# EAGLE design RGB Panel Shield for Arduino (EAGLE 9.0.0)
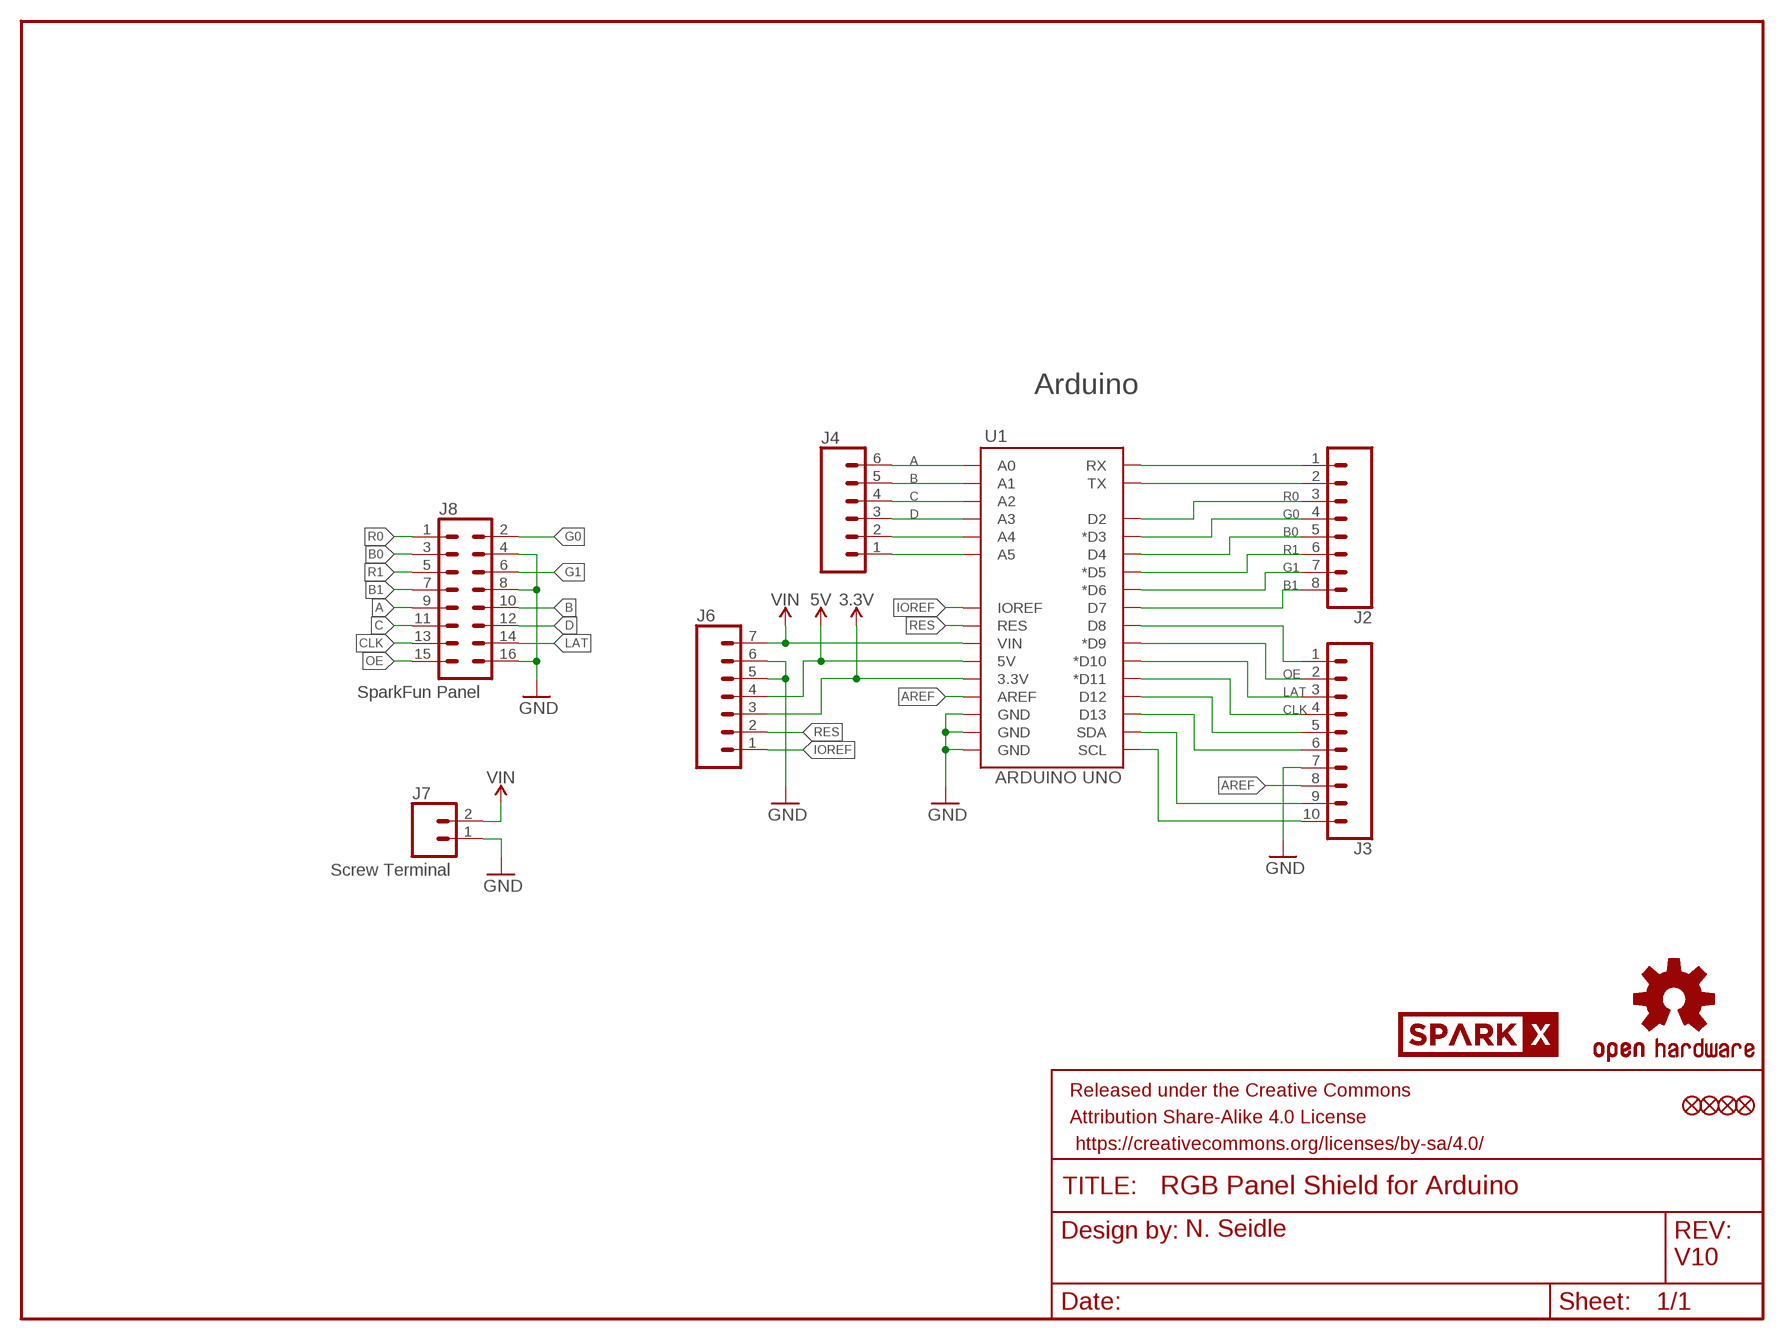
[diagram p0: schematic, sheet 1]

## Parts
FD1  FIDUCIAL1X2  [FIDUCIAL-1X2]
FD2  FIDUCIAL1X2  [FIDUCIAL-1X2]
FD3  FIDUCIAL1X2  [FIDUCIAL-1X2]
FD4  FIDUCIAL1X2  [FIDUCIAL-1X2]
FRAME1  FRAME-LETTER  [CREATIVE_COMMONS]
J2  CONN_08NO_SILK_FEMALE_PTH  [1X08_NO_SILK]
J3  CONN_10NO_SILK_PTH_FEMALE  [1X10_NO_SILK]
J4  CONN_06NO_SILK_FEMALE_PTH  [1X06_NO_SILK]
J6  CONN_07NO_SILK  [1X07_NO_SILK]
J7  Screw Terminal  CONN_025MM  [SCREWTERMINAL-5MM-2]
J8  SparkFun Panel  CONN_08X2_SHROUD  [2X8-SHROUDED_LOCK]
LOGO1  OSHW-LOGOMINI  [OSHW-LOGO-MINI]
U1  ARDUINO UNO  ARDUINO_R3_SHIELDNOLABELS  [UNO_R3_SHIELD_NOLABELS]
U$91  SPARKX-LOGO4  [SPARKX-MEDIUM]

## Nets
3.3V: J6.3 U1.3.3V
5V: J6.4 U1.5V
A: J4.6 J8.9 U1.A0
A4: J4.2 U1.A4
A5: J4.1 U1.A5
AREF: J3.8 U1.AREF
B: J4.5 J8.10 U1.A1
B0: J2.5 J8.3 U1.D4
B1: J2.8 J8.7 U1.D7
C: J4.4 J8.11 U1.A2
CLK: J3.4 J8.13 U1.D11(*D11)
D: J4.3 J8.12 U1.A3
D8: J3.1 U1.D8
D12: J3.5 U1.D12
D13: J3.6 U1.D13
G0: J2.4 J8.2 U1.D3(*D3)
G1: J2.7 J8.6 U1.D6(*D6)
GND [vcc]: J3.7 J6.5 J6.6 J7.1 J8.4 J8.8 J8.16 U1.GND@0(GND) U1.GND@1(GND) U1.GND@2(GND)
IOREF: J6.1 U1.IOREF
LAT: J3.3 J8.14 U1.D10(*D10)
OE: J3.2 J8.15 U1.D9(*D9)
R0: J2.3 J8.1 U1.D2
R1: J2.6 J8.5 U1.D5(*D5)
RES: J6.2 U1.RES
RX: J2.1 U1.RX
SCL1: J3.10 U1.SCL
SDA1: J3.9 U1.SDA
TX: J2.2 U1.TX
VIN [vcc]: J6.7 J7.2 U1.VIN

## Notes on the sheet
- Arduino
- N. Seidle
- V10

## Library data of the parts
FD1-FD4 = SparkFun-Aesthetics:FIDUCIAL: Fiducial Alignment Points Point-of-reference for pick-and-place machines and other optical instruments.
FRAME1 = SparkFun-Aesthetics:FRAME-LETTER: Schematic Frame - Letter Standard 8.5x11 US Letter frame
J2 = SparkFun-Connectors:CONN_08: Multi connection point. Often used as Generic Header-pin footprint for 0.1 inch spaced/style header connections On any of the 0.1 inch spaced packages, you can populate with these: Break Away Headers - Straight <https://www.sparkfun.com/products/116> (PRT-00116) Break Away Male Headers - Right Angle <https://www.sparkfun.com/products/553> (PRT-00553) Female Headers <https://www.sparkfun.com/products/115> (PRT-00115) Break Away Headers - Machine Pin <https://www.sparkfun.com/products/117> (PRT-00117) Break Away Female Headers - Swiss Machine Pin <https://www.sparkfun.com/products/743> (PRT-00743) Arduino Stackable Header - 8 Pin <https://www.sparkfun.com/products/9279> (PRT-09279) For SCREWTERMINALS and SPRING TERMINALS visit here: Screw Terimnals on SparkFun.com <https://www.sparkfun.com/search/results?term=Screw+Terminals> (5mm/3.5mm/2.54mm spacing) This device is also useful as a general connection point to wire up your design to another part of your project. Our various solder wires solder well into these plated through hole pads. Hook-Up Wire - Assortment (Stranded, 22 AWG) <https://www.sparkfun.com/products/11375> (PRT-11375) Hook-Up Wire - Assortment (Solid Core, 22 AWG) <https://www.sparkfun.com/products/11367> (PRT-11367) View the entire wire category on our website here <https://www.sparkfun.com/categories/141> Special notes: Molex polarized connector foot print use with SKU : PRT-08231 with associated crimp pins and housings. 1MM SMD Version SKU: PRT-10208 NOTES ON THE VARIANTS LOCK and LOCK_LONGPADS... This footprint was designed to help hold the alignment of a through-hole component (i.e. 6-pin header) while soldering it into place. You may notice that each hole has been shifted either up or down by 0.005 of an inch from it's more standard position (which is a perfectly straight line). This slight alteration caused the pins (the squares in the middle) to touch the edges of the holes. Because they are alternating, it causes a "brace" to hold the component in place. 0.005 has proven to be the perfect amount of "off-center" position when using our standard breakaway headers. Although looks a little odd when you look at the bare footprint, once you have a header in there, the alteration is very hard to notice. Also,if you push a header all the way into place, it is covered up entirely on the bottom side.; PROD_ID: CONN-08438
J3 = SparkFun-Connectors:CONN_10: Multi connection point. Often used as Generic Header-pin footprint for 0.1 inch spaced/style header connections On any of the 0.1 inch spaced packages, you can populate with these: Break Away Headers - Straight <https://www.sparkfun.com/products/116> (PRT-00116) Break Away Male Headers - Right Angle <https://www.sparkfun.com/products/553> (PRT-00553) Female Headers <https://www.sparkfun.com/products/115> (PRT-00115) Break Away Headers - Machine Pin <https://www.sparkfun.com/products/117> (PRT-00117) Break Away Female Headers - Swiss Machine Pin <https://www.sparkfun.com/products/743> (PRT-00743) Arduino Stackable Header - 10 Pin <https://www.sparkfun.com/products/11376> (PRT-11376) For SCREWTERMINALS and SPRING TERMINALS visit here: Screw Terimnals on SparkFun.com <https://www.sparkfun.com/search/results?term=Screw+Terminals> (5mm/3.5mm/2.54mm spacing) This device is also useful as a general connection point to wire up your design to another part of your project. Our various solder wires solder well into these plated through hole pads. Hook-Up Wire - Assortment (Stranded, 22 AWG) <https://www.sparkfun.com/products/11375> (PRT-11375) Hook-Up Wire - Assortment (Solid Core, 22 AWG) <https://www.sparkfun.com/products/11367> (PRT-11367) View the entire wire category on our website here <https://www.sparkfun.com/categories/141> Special notes: Molex polarized connector foot print use with SKU : PRT-08231 with associated crimp pins and housings. 1MM SMD Version SKU: PRT-10208 NOTES ON THE VARIANTS LOCK and LOCK_LONGPADS... This footprint was designed to help hold the alignment of a through-hole component (i.e. 6-pin header) while soldering it into place. You may notice that each hole has been shifted either up or down by 0.005 of an inch from it's more standard position (which is a perfectly straight line). This slight alteration caused the pins (the squares in the middle) to touch the edges of the holes. Because they are alternating, it causes a "brace" to hold the component in place. 0.005 has proven to be the perfect amount of "off-center" position when using our standard breakaway headers. Although looks a little odd when you look at the bare footprint, once you have a header in there, the alteration is very hard to notice. Also,if you push a header all the way into place, it is covered up entirely on the bottom side.; PROD_ID: CONN-11563
J4 = SparkFun-Connectors:CONN_06: Multi connection point. Often used as Generic Header-pin footprint for 0.1 inch spaced/style header connections On any of the 0.1 inch spaced packages, you can populate with these: Break Away Headers - Straight <https://www.sparkfun.com/products/116> (PRT-00116) Break Away Male Headers - Right Angle <https://www.sparkfun.com/products/553> (PRT-00553) Female Headers <https://www.sparkfun.com/products/115> (PRT-00115) Break Away Headers - Machine Pin <https://www.sparkfun.com/products/117> (PRT-00117) Break Away Female Headers - Swiss Machine Pin <https://www.sparkfun.com/products/743> (PRT-00743) Arduino Stackable Header - 6 Pin <https://www.sparkfun.com/products/9280> (PRT-09280) For SCREWTERMINALS and SPRING TERMINALS visit here: Screw Terimnals on SparkFun.com <https://www.sparkfun.com/search/results?term=Screw+Terminals> (5mm/3.5mm/2.54mm spacing) This device is also useful as a general connection point to wire up your design to another part of your project. Our various solder wires solder well into these plated through hole pads. Hook-Up Wire - Assortment (Stranded, 22 AWG) <https://www.sparkfun.com/products/11375> (PRT-11375) Hook-Up Wire - Assortment (Solid Core, 22 AWG) <https://www.sparkfun.com/products/11367> (PRT-11367) View the entire wire category on our website here <https://www.sparkfun.com/categories/141>; PROD_ID: CONN-08437
J6 = SparkFun-Connectors:CONN_07: Multi connection point. Often used as Generic Header-pin footprint for 0.1 inch spaced/style header connections On any of the 0.1 inch spaced packages, you can populate with these: Break Away Headers - Straight <https://www.sparkfun.com/products/116> (PRT-00116) Break Away Male Headers - Right Angle <https://www.sparkfun.com/products/553> (PRT-00553) Female Headers <https://www.sparkfun.com/products/115> (PRT-00115) Break Away Headers - Machine Pin <https://www.sparkfun.com/products/117> (PRT-00117) Break Away Female Headers - Swiss Machine Pin <https://www.sparkfun.com/products/743> (PRT-00743) For SCREWTERMINALS and SPRING TERMINALS visit here: Screw Terimnals on SparkFun.com <https://www.sparkfun.com/search/results?term=Screw+Terminals> (5mm/3.5mm/2.54mm spacing) This device is also useful as a general connection point to wire up your design to another part of your project. Our various solder wires solder well into these plated through hole pads. Hook-Up Wire - Assortment (Stranded, 22 AWG) <https://www.sparkfun.com/products/11375> (PRT-11375) Hook-Up Wire - Assortment (Solid Core, 22 AWG) <https://www.sparkfun.com/products/11367> (PRT-11367) View the entire wire category on our website here <https://www.sparkfun.com/categories/141> Special notes: Molex polarized connector foot print use with SKU : PRT-08231 with associated crimp pins and housings. 1MM SMD Version SKU: PRT-10208 NOTES ON THE VARIANTS LOCK and LOCK_LONGPADS... This footprint was designed to help hold the alignment of a through-hole component (i.e. 6-pin header) while soldering it into place. You may notice that each hole has been shifted either up or down by 0.005 of an inch from it's more standard position (which is a perfectly straight line). This slight alteration caused the pins (the squares in the middle) to touch the edges of the holes. Because they are alternating, it causes a "brace" to hold the component in place. 0.005 has proven to be the perfect amount of "off-center" position when using our standard breakaway headers. Although looks a little odd when you look at the bare footprint, once you have a header in there, the alteration is very hard to notice. Also,if you push a header all the way into place, it is covered up entirely on the bottom side.
J7 = SparkFun-Connectors:CONN_02: Multi connection point. Often used as Generic Header-pin footprint for 0.1 inch spaced/style header connections On any of the 0.1 inch spaced packages, you can populate with these: Break Away Headers - Straight <https://www.sparkfun.com/products/116> (PRT-00116) Break Away Male Headers - Right Angle <https://www.sparkfun.com/products/553> (PRT-00553) Female Headers <https://www.sparkfun.com/products/115> (PRT-00115) Break Away Headers - Machine Pin <https://www.sparkfun.com/products/117> (PRT-00117) Break Away Female Headers - Swiss Machine Pin <https://www.sparkfun.com/products/743> (PRT-00743) For SCREWTERMINALS and SPRING TERMINALS visit here: Screw Terimnals on SparkFun.com <https://www.sparkfun.com/search/results?term=Screw+Terminals> (5mm/3.5mm/2.54mm spacing) This device is also useful as a general connection point to wire up your design to another part of your project. Our various solder wires solder well into these plated through hole pads. Hook-Up Wire - Assortment (Stranded, 22 AWG) <https://www.sparkfun.com/products/11375> (PRT-11375) Hook-Up Wire - Assortment (Solid Core, 22 AWG) <https://www.sparkfun.com/products/11367> (PRT-11367) View the entire wire category on our website here <https://www.sparkfun.com/categories/141> Special notes: Molex polarized connector foot print use with: PRT-08233 with associated crimp pins and housings. 2.54_SCREWTERM for use with PRT-10571. 3.5mm Screw Terminal footprints for PRT-08084 5mm Screw Terminal footprints for use with PRT-08432; SF_SKU: PRT-08432
J8 = SparkFun-Connectors:CONN_08X2: Multi connection point. Often used as Generic Header-pin footprint for 0.1 inch spaced/style header connections You can populate with any combo of single row headers, but if you'd like an exact match, check this: Header - 2x8 (Male, 0.1") <https://www.sparkfun.com/products/13156> (PRT-13156) On any of the 0.1 inch spaced packages, you can populate with these: Break Away Headers - Straight <https://www.sparkfun.com/products/116> (PRT-00116) Break Away Male Headers - Right Angle <https://www.sparkfun.com/products/553> (PRT-00553) Female Headers <https://www.sparkfun.com/products/115> (PRT-00115) Break Away Headers - Machine Pin <https://www.sparkfun.com/products/117> (PRT-00117) Break Away Female Headers - Swiss Machine Pin <https://www.sparkfun.com/products/743> (PRT-00743)
LOGO1 = SparkFun-Aesthetics:OSHW-LOGO: Open-Source Hardware (OSHW) Logo This logo indicates the piece of hardware it is found on incorporates a OSHW license and/or adheres to the definition of open source hardware found here: http://freedomdefined.org/OSHW
U1 = SparkFun-Boards:ARDUINO_R3_SHIELD: Shield form compatible with the Arduino Uno R3.
U$91 = SparkX:SPARKX-LOGO

## Net classes
0 Default: width 0.152 mm
1 vcc: width 0.152 mm

## Board
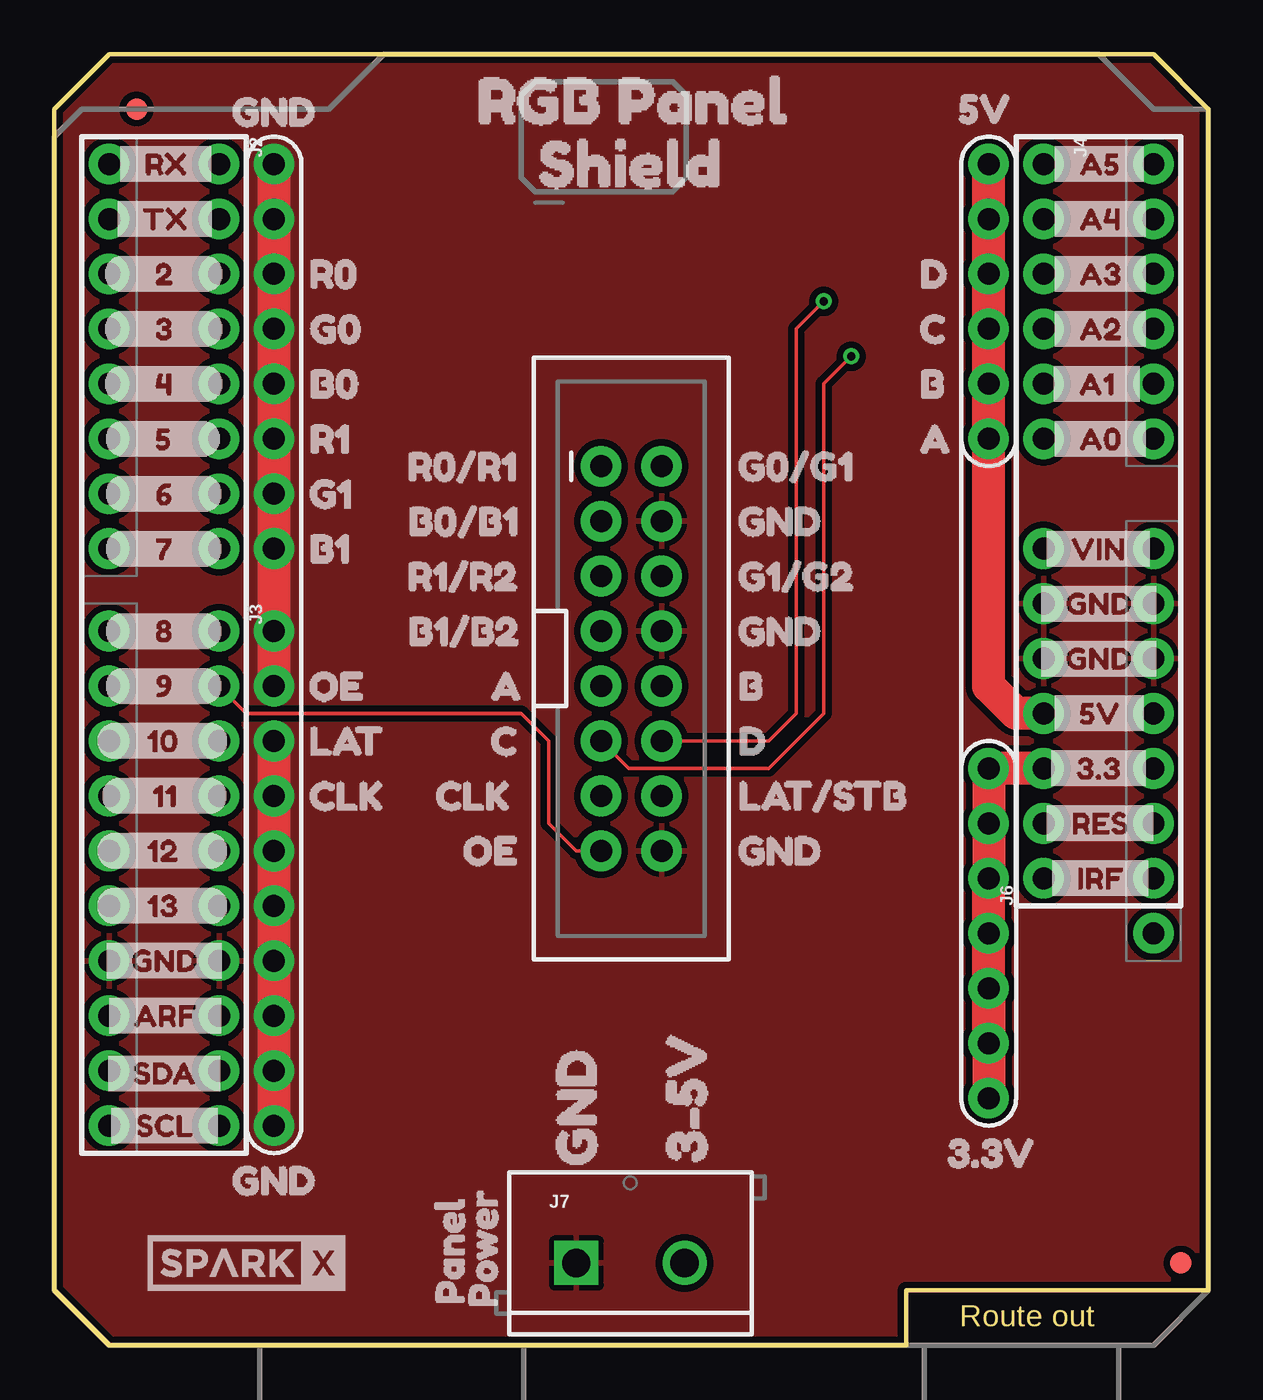
[diagram p1: board, top side]
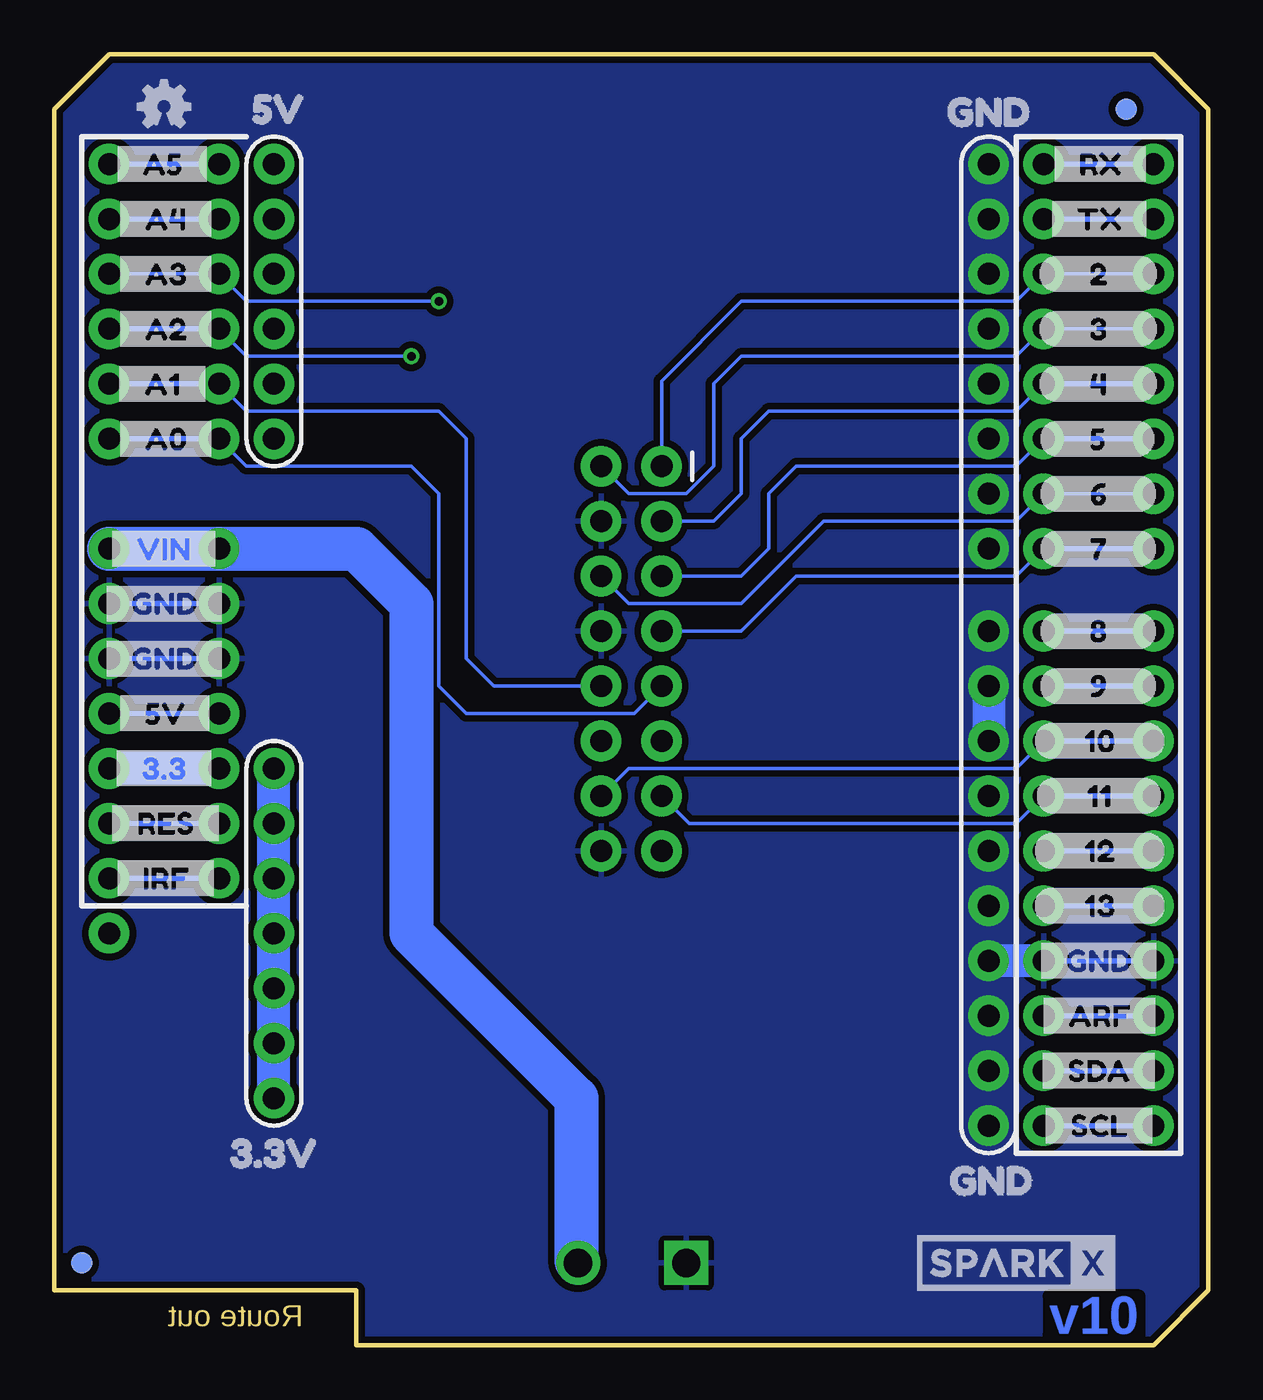
[diagram p2: board, bottom side, seen from below]

Size 53.34 x 59.69 mm. Coordinates in mm from the lower left corner, seen from the top.
Outline: 53.34,2.54 53.34,57.15 50.8,59.69 2.54,59.69 0,57.15 0,2.54 2.54,0 39.37,0 39.37,2.54 53.34,2.54
Copper layers (1*16): Top 0.035mm / dielectric 1.5mm / Bottom 0.035mm
Design rules "SparkFun-2-layer-PCBWay-LIMIT": minimum track width 6mil, minimum drill 0.3mm, track to track 6mil, track to pad 6mil, pad to pad 6mil, via to via 6mil, smd to smd 6mil, copper to edge 6mil, drill to drill 6mil, minimum pad ring 7mil, minimum via ring 7mil, stop-mask expansion 4mil, vias tented up to drill 25mil, thermal gap 10mil

### Footprints (pad centres in the part's own frame; a part is rotated, then mirrored left to right if it is on the bottom)
FIDUCIAL-1X2 = smd 1 x 1: 1 0,0
1X08_NO_SILK = drill 1.016 pad 1.88: 1 0,0; 2 2.54,0; 3 5.08,0; 4 7.62,0; 5 10.16,0; 6 12.7,0; 7 15.24,0; 8 17.78,0
1X10_NO_SILK = drill 1.016 pad 1.88: 1 0,0; 2 2.54,0; 3 5.08,0; 4 7.62,0; 5 10.16,0; 6 12.7,0; 7 15.24,0; 8 17.78,0; 9 20.32,0; 10 22.86,0
1X06_NO_SILK = drill 1.016 pad 1.88: 1 0,0; 2 2.54,0; 3 5.08,0; 4 7.62,0; 5 10.16,0; 6 12.7,0
1X07_NO_SILK = drill 1.016 pad 1.88: 1 0,0; 2 2.54,0; 3 5.08,0; 4 7.62,0; 5 10.16,0; 6 12.7,0; 7 15.24,0
SCREWTERMINAL-5MM-2 = drill 1.3 pad 2.032 square: 1 0,0 | drill 1.3 pad 2.032: 2 5,0
2X8-SHROUDED_LOCK = drill 1.016 pad 1.88: 1 -1.397,8.89; 2 1.397,8.89; 3 -1.397,6.35; 4 1.397,6.35; 5 -1.397,3.81; 6 1.397,3.81; 7 -1.397,1.27; 8 1.397,1.27; 9 -1.397,-1.27; 10 1.397,-1.27; 11 -1.397,-3.81; 12 1.397,-3.81; 13 -1.397,-6.35; 14 1.397,-6.35; 15 -1.397,-8.89; 16 1.397,-8.89
UNO_R3_SHIELD_NOLABELS = drill 1.016 pad 1.88: 3.3V 50.8,26.67; 5V 50.8,29.21; A0 50.8,41.91; A1 50.8,44.45; A2 50.8,46.99; A3 50.8,49.53; A4 50.8,52.07; A5 50.8,54.61; AREF 2.54,15.24; D2 2.54,49.53; D3 2.54,46.99; D4 2.54,44.45; D5 2.54,41.91; D6 2.54,39.37; D7 2.54,36.83; D8 2.54,33.02; D9 2.54,30.48; D10 2.54,27.94; D11 2.54,25.4; D12 2.54,22.86; D13 2.54,20.32; GND@0 50.8,31.75; GND@1 50.8,34.29; GND@2 2.54,17.78; IOREF 50.8,21.59; NC 50.8,19.05; RES 50.8,24.13; RX 2.54,54.61; SCL 2.54,10.16; SDA 2.54,12.7; TX 2.54,52.07; VIN 50.8,36.83

### Placement (x,y rotation side)
FD1  52.07,3.81 0 top
FD2  3.81,57.15 0 top
FD3  52.07,3.81 0 bottom
FD4  3.81,57.15 0 bottom
FRAME1  -8.89,-27.94 0 top  (outside the outline)
J2  7.62,54.61 270 top
J3  7.62,33.02 270 top
J4  45.72,54.61 270 top
J6  45.72,21.59 90 top
J7  24.13,3.81 0 top
J8  26.67,31.75 0 top
LOGO1  48.26,57.28 0 bottom
U1  0,0 0 top
U$1  [D42]  38.86,49.53 0 top
U$2  [SPARKX-MEDIUM]  8.89,3.81 0 top
U$3  [C37]  19.05,27.94 0 top
U$4  [GND48]  30.48,38.1 0 top
U$5  [3#5V3]  29.21,6.86 90 top
U$6  [____2____1]  2.29,49.53 0 top
U$7  [____3____3]  2.29,46.99 0 top
U$8  [____4____4]  2.29,44.45 0 top
U$9  [____5____5]  2.29,41.91 0 top
U$10  [____6____6]  2.29,39.37 0 top
U$11  [GND2]  24.13,6.73 90 top
U$12  [____7____7]  2.29,36.83 0 top
U$13  [____8____8]  2.29,33.02 0 top
U$14  [____9____9]  2.29,30.48 0 top
U$15  [____10____10]  1.91,27.94 0 top
U$16  [PANEL0]  18.29,0.76 90 top
U$17  [____11____11]  2.16,25.4 0 top
U$18  [____12____12]  1.91,22.86 0 top
U$19  [POWER1]  19.81,0.64 90 top
U$20  [____13____13]  1.91,20.32 0 top
U$21  [GND40]  7.11,7.62 0 top
U$22  [GND40]  7.11,57.02 0 top
U$23  [RGB_PANEL2]  17.78,57.53 0 top
U$24  [__RX__0]  2.54,54.61 0 top
U$25  [3#3V46]  40.13,8.89 0 top
U$26  [5V47]  40.64,57.15 0 top
U$27  [__3#3__27]  50.93,26.67 0 bottom
U$28  [A36]  19.05,30.48 0 top
U$29  [B0#B132]  15.24,38.1 0 top
U$30  [B1#B235]  15.24,33.02 0 top
U$31  [B43]  30.48,30.48 0 top
U$32  [C37]  19.05,27.94 0 top
U$33  [CLK38]  16.51,25.4 0 top
U$34  [D42]  30.48,27.94 0 top
U$35  [G0#G145]  30.48,40.64 0 top
U$36  [G1#G244]  30.48,35.56 0 top
U$37  [GND40]  30.48,22.86 0 top
U$38  [GND48]  30.48,33.02 0 top
U$39  [LAT#STB41]  30.48,25.4 0 top
U$40  [OE39]  17.78,22.86 0 top
U$41  [R0#R131]  15.24,40.64 0 top
U$42  [R1#R234]  15.24,35.56 0 top
U$43  [__5V__26]  50.8,29.21 0 bottom
U$44  [__A0__23]  45.72,41.91 0 top
U$45  [__3#3__27]  45.59,26.67 0 top
U$46  [__A1__22]  45.72,44.45 0 top
U$47  [__A2__21]  45.72,46.99 0 top
U$48  [__5V__26]  45.72,29.21 0 top
U$49  [__A3__20]  45.72,49.53 0 top
U$50  [__A4__19]  45.72,52.07 0 top
U$51  [__A5__18]  45.72,54.61 0 top
U$52  [__ARF__15]  2.03,15.24 0 top
U$53  [__GND__14]  1.91,17.78 0 top
U$54  [__GND__25]  45.09,31.75 0 top
U$55  [__GND__25]  45.09,34.29 0 top
U$56  [__IRF__29]  45.59,21.59 0 top
U$57  [__RES__28]  45.34,24.13 0 top
U$58  [__SCL__17]  2.16,10.16 0 top
U$59  [__SDA__16]  2.03,12.57 0 top
U$60  [__TX__0]  2.41,52.07 0 top
U$61  [__VIN__24]  45.34,36.83 0 top
U$62  [__A0__23]  50.8,41.91 0 bottom
U$63  [__A1__22]  50.8,44.45 0 bottom
U$64  [__A2__21]  50.8,46.99 0 bottom
U$65  [__A3__20]  50.8,49.53 0 bottom
U$66  [__A4__19]  50.8,52.07 0 bottom
U$67  [__GND__25]  51.44,31.75 0 bottom
U$68  [__GND__25]  51.44,34.29 0 bottom
U$69  [__RES__28]  51.18,24.13 0 bottom
U$70  [__VIN__24]  51.18,36.83 0 bottom
U$71  [__IRF__29]  50.93,21.59 0 bottom
U$72  [__A5__18]  50.93,54.61 0 bottom
U$73  [__RX__0]  7.62,54.61 0 bottom
U$74  [__ARF__15]  8.13,15.24 0 bottom
U$75  [__GND__14]  8.26,17.78 0 bottom
U$76  [__SCL__17]  8,10.16 0 bottom
U$77  [__SDA__16]  8.13,12.7 0 bottom
U$78  [__TX__0]  7.75,52.07 0 bottom
U$79  [____2____1]  7.87,49.53 0 bottom
U$80  [____3____3]  7.87,46.99 0 bottom
U$81  [____4____4]  7.87,44.45 0 bottom
U$82  [____5____5]  7.87,41.91 0 bottom
U$83  [____6____6]  7.87,39.37 0 bottom
U$84  [____7____7]  7.87,36.83 0 bottom
U$85  [____8____8]  7.87,33.02 0 bottom
U$86  [____9____9]  7.87,30.48 0 bottom
U$87  [____10____10]  8.13,27.94 0 bottom
U$88  [____11____11]  8,25.4 0 bottom
U$89  [____12____12]  8.13,22.86 0 bottom
U$90  [____13____13]  8.13,20.32 0 bottom
U$91  -24.13,-30.48 0 top  (outside the outline)
U$107  [5V47]  45.34,57.15 0 bottom
U$108  [GND40]  13.21,57.02 0 bottom
U$109  [GND40]  13.08,7.62 0 bottom
U$110  [3#3V46]  46.35,8.89 0 bottom
U$112  [B15]  10.67,36.83 0 top
U$113  [C37]  38.86,46.99 0 top
U$114  [B43]  38.86,44.45 0 top
U$115  [A36]  38.86,41.91 0 top
U$116  [B03]  10.67,44.45 0 top
U$117  [G01]  10.67,46.99 0 top
U$118  [G14]  10.67,39.37 0 top
U$119  [R00]  10.67,49.53 0 top
U$120  [R12]  10.67,41.91 0 top
U$121  [CLK38]  10.67,25.4 0 top
U$122  [OE39]  10.67,30.48 0 top
U$123  [LAT0]  10.67,27.94 0 top
U$124  [SHIELD0]  20.57,54.61 0 top
U$128  [SPARKX-MEDIUM]  8.89,3.81 0 bottom

### Tracks (layer width: path | path; a pad name or v marks a point on that pad's centre or on a via)
3.3V  (via drill 1.02 pad 1.88)
  Top 1.524: J6.3 v43.18,26.67 v43.18,24.13 v43.18,21.59 v43.18,19.05 v43.18,16.51 | v43.18,16.51 v43.18,11.43 | v43.18,13.97 v43.18,16.51
  Bottom 1.524: J6.3 U1.3.3V | v43.18,11.43 v43.18,26.67
5V  (via drill 1.02 pad 1.88)
  Top 0.152: v43.18,41.91 v43.18,44.45
  Top 1.524: J6.4 44.45,29.21 43.18,30.48 v43.18,44.45 v43.18,46.99 v43.18,49.53 v43.18,52.07 v43.18,54.61
  Bottom 0.254: J6.4 U1.5V
A
  Bottom 0.152: J8.9 26.54,29.21 34.29,29.21 35.56,30.48 35.56,39.37 36.83,40.64 44.45,40.64 J4.6
  Bottom 0.254: J4.6 U1.A0
A4
  Bottom 0.254: J4.2 U1.A4
A5
  Bottom 0.254: U1.A5 J4.1
AREF
  Bottom 0.254: U1.AREF J3.8
B
  Bottom 0.152: J8.10 33.02,30.48 34.29,31.75 34.29,41.91 35.56,43.18 44.45,43.18 J4.5
  Bottom 0.254: U1.A1 J4.5
B0
  Bottom 0.152: J2.5 8.89,43.18 20.32,43.18 21.59,41.91 21.59,39.37 22.86,38.1 J8.3
  Bottom 0.254: J2.5 U1.D4
B1
  Bottom 0.152: J2.8 8.89,35.56 19.05,35.56 21.59,33.02 J8.7
  Bottom 0.254: U1.D7 J2.8
C  (via drill 0.38)
  Top 0.152: v36.83,45.72 35.56,44.45 35.56,29.21 33.02,26.67 26.54,26.67 J8.11
  Bottom 0.152: J4.4 44.45,45.72 v36.83,45.72
  Bottom 0.254: J4.4 U1.A2
CLK
  Bottom 0.152: J3.4 8.89,24.13 24,24.13 J8.13
  Bottom 0.254: U1.D11 J3.4
D  (via drill 0.38)
  Top 0.152: v35.56,48.26 34.29,46.99 34.29,29.21 33.02,27.94 J8.12
  Bottom 0.152: v35.56,48.26 44.45,48.26 J4.3 U1.A3
D8
  Bottom 0.254: J3.1 U1.D8
D12
  Bottom 0.254: J3.5 U1.D12
D13
  Bottom 0.254: U1.D13 J3.6
G0
  Bottom 0.152: J8.2 26.8,39.37 24.13,39.37 22.86,40.64 22.86,44.45 21.59,45.72 8.89,45.72 J2.4 U1.D3
G1
  Bottom 0.152: J8.6 26.8,34.29 21.59,34.29 17.78,38.1 8.89,38.1 J2.7 U1.D6
GND  (via drill 1.02 pad 1.88)
  Top 1.524: v10.16,54.61 v10.16,52.07 v10.16,49.53 v10.16,46.99 v10.16,44.45 v10.16,41.91 v10.16,39.37 v10.16,36.83 v10.16,33.02 v10.16,30.48 | v10.16,27.94 v10.16,25.4 v10.16,22.86 v10.16,20.32 v10.16,17.78 v10.16,15.24 v10.16,12.7 v10.16,10.16
  Bottom 0.254: U1.GND@1 J6.6 | J6.5 U1.GND@0 | J3.7 U1.GND@2
  Bottom 1.524: J3.7 v10.16,17.78 | v10.16,30.48 v10.16,27.94
  pour Top (isolate 0.305): 53.34,0 0,0 0,59.69 53.34,59.69
  pour Bottom (isolate 0.305): 53.34,0 0,0 0,59.69 53.34,59.69
IOREF
  Bottom 0.254: J6.1 U1.IOREF
LAT
  Bottom 0.152: J3.3 8.89,26.67 26.8,26.67 J8.14
  Bottom 0.254: J3.3 U1.D10
OE
  Top 0.152: J3.2 8.89,29.21 21.59,29.21 22.86,27.94 22.86,24.13 24.13,22.86 J8.15
  Bottom 0.254: U1.D9 J3.2
R0
  Bottom 0.152: J8.1 25.27,44.58 21.59,48.26 8.89,48.26 J2.3 U1.D2
R1
  Bottom 0.152: J2.6 8.89,40.64 19.05,40.64 20.32,39.37 20.32,36.83 21.59,35.56 J8.5
  Bottom 0.254: U1.D5 J2.6
RES
  Bottom 0.254: U1.RES J6.2
RX
  Bottom 0.254: J2.1 U1.RX
SCL1
  Bottom 0.254: J3.10 U1.SCL
SDA1
  Bottom 0.254: U1.SDA J3.9
TX
  Bottom 0.254: U1.TX J2.2
VIN
  Bottom 2.032: U1.VIN J6.7 39.37,36.83 36.83,34.29 36.83,19.05 29.21,11.43 29.21,3.89 J7.2

### Text on the board
Bottom: v10
Dimension: Route out
Measures: Measurements in in
tDocu: N. Seidle